# Altium schematic sheet Fan.SchDoc
size A4; SheetNumber: 9; SheetTotal: 16
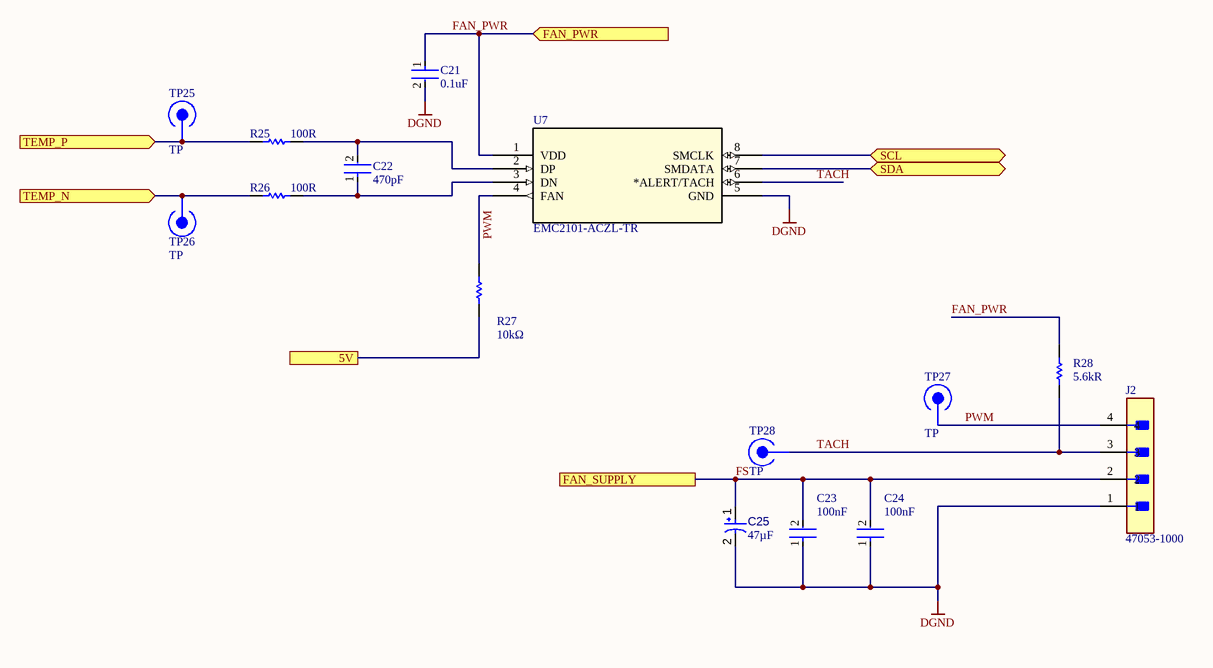
[diagram p0: Fan.SchDoc]

## Parts
C21  value 0.1uF  [FP-CC0402-IPC_C]  (hidden comment: CC0402KRX7R7BB104)
C22  value 470pF  [FP-0402-L_1_0_1-W_0_5_0_1-IPC_C]  (hidden comment: C0402C471K5RACTU)
C23  value 100nF  [FP-CC0402-IPC_B]  (hidden comment: CC0402KRX7R9BB104)
C24  value 100nF  [FP-CC0402-IPC_B]  (hidden comment: CC0402KRX7R9BB104)
C25  value 47µF  [VISH-7343-31_N]  (hidden comment: 293D476X9016D2TE3)
J2  47053-1000  [FP-470531000-MFG]
R25  value 100R  [RESC1005X40X25LL10T10]  (hidden comment: RK73H1ETTP1000F)
R26  value 100R  [RESC1005X40X25LL10T10]  (hidden comment: RK73H1ETTP1000F)
R27  value 10kΩ  [RESC1005X40X25LL10T10]  (hidden comment: RK73B1ETTP103J)
R28  value 5.6kR  [RESC1005X40X25LL10T10]  (hidden comment: RK73H1ETTP5601F)
TP25  TP  [TP-Footprint-1]
TP26  TP  [TP-Footprint-1]
TP27  TP  [TP-Footprint-1]
TP28  TP  [TP-Footprint-1]
U7  EMC2101-ACZL-TR  [EMC2101-ACZL-TR-Footprint-1]

## Ports
5V, FAN_PWR (in), FAN_SUPPLY, SCL (bidir), SDA (bidir), TEMP_N (in), TEMP_P (in)

## Nets
DGND: C21.2 C23.1 C24.1 C25.2 J2.1 U7.5(GND)
5V: R27.2 ; port 5V
FAN_PWR: C21.1 R28.2 U7.1(VDD) ; port FAN_PWR
FS: C23.2 C24.2 C25.1 J2.2 ; port FAN_SUPPLY
PWM: J2.4 R27.1 TP27.1 U7.4(FAN)
SCL: U7.8(SMCLK) ; port SCL
SDA: U7.7(SMDATA) ; port SDA
TACH: J2.3 R28.1 TP28.1 U7.6(*ALERT/TACH)
TEMP_N: R26.1 TP26.1 ; port TEMP_N
TEMP_P: R25.1 TP25.1 ; port TEMP_P
NetC22_1: C22.1 R26.2 U7.3(DN)
NetC22_2: C22.2 R25.2 U7.2(DP)

## Library data of the parts
C21 = CMP-001-00094-1: Multilayer Ceramic Capacitor, 0.1 uF, 25 V, ± 10%, X7R, 0402 [1005 Metric]; Rating: 16V; Reel Size: 8mm; Vendor: TTI; Category: Capacitor; Price: 0.004; Package: 0402; MOQ: 10000
C22 = CMP-001-00097-1: CAPACITOR - Ceramic Chip Cap, 0402, 470 pf, 10%, 50V, X7R; Reel Size: 8mm; Vendor: TTI; Price: 0.003; MOQ: 10000; Package: 0402; Category: Capacitor; Rating: 50V
C23 C24 = CMP-x00152-1: Ceramic Capacitor, Multilayer, Ceramic, 50V, 10% +Tol, 10% -Tol, X7R, 15% TC, 0.1uF, Surface Mount, 0402
C25 = CMP-001-00022-7: Solid Tantalum Chip Capacitor, 47 uF, +/- 10%, 16 V, -55 to 125 degC, 2917 (7343 Metric), RoHS, Tape and Reel; Manufacturer: Vishay Semiconductor; Voltage Rating: 16V; Datasheet URL: http://www.vishay.com/docs/40002/293d.pdf; Max Operating Temperature: 125°C; Packaging: TapeandReel; Mounting Technology: SM; Capacitor Type: Tantalum; Tolerance: 10%; Min Operating Temperature: -55°C; Package Reference: 7343-31; RoHS Compliant: Unknown; Manufacturer URL: http://www.vishay.com/; Datasheet Version: Aug-16; Package Description: 2-Pin Surface Mount Device, Body 7.3 x 4.3 mm; Case/Package: 7343-31
J2 = CMP-04776-000290-2: CONN HEADER VERT 4POS 2.54MM; NexarPartId: 854935; Manufacturer Lifecycle Status: ACTIVE; Voltage Rating (DC): 250V; Gender: Male; Plating: Copper; Number of Positions: 4; Glow Wire Compliant: Non-compliant; Current Rating: 500mA; Max Operating Temperature: 75°C; Number of Rows: 1; REACH SVHC: Unknown; Ambient Temperature Range High: 105°C; Pitch: 2.54mm; Height: 7.7mm; Min Operating Temperature: 0°C; Packaging: Bulk; Contact Material: Brass, Copper; Contact Plating: Tin; Lead Pitch: 2.54mm; Voltage Rating: 250V; Termination: Through Hole; Radiation Hardening: No; Orientation: Vertical; Mount: Through Hole; Number of Pins: 4; Country of Origin: HK; Halogen Free: Low Halogen; Lifecycle Status: Production; Number of Circuits: 4; Schedule B: 8536694040, 8536694040; Housing Color: Beige; Housing Material: Nylon; Depth: 5.84mm; RoHS: Compliant; Length: 10.2mm; Number of Contacts: 4
R25 R26 = CMP-x00174-1: Fixed Resistor, Metal Glaze/thick Film, 0.1W, 100ohm, 75V, 1% +/-Tol, 100ppm/Cel, Surface Mount, 0402
R27 = CMP-009-00227-1: Fixed Resistor, Metal Glaze/thick Film, 0.1W, 10000ohm, 75V, 5% +/-Tol, 200ppm/Cel, Surface Mount, 0402; Rating: 1/10W; Vendor: TTI; Package: 0402; Price: 0.0017; Category: Resistor
R28 = CMP-x00164-1: Fixed Resistor, Metal Glaze/thick Film, 0.1W, 5600ohm, 75V, 1% +/-Tol, 100ppm/Cel, Surface Mount, 0402
TP25-TP28 = CMP-001-0086-3: digital shovel test point
U7 = CMP-x00137-1: Serial Switch/Digital Sensor, 11 Bit(s), 2Cel, Square, Surface Mount; Manufacturer: Microchip; Reel Width: 8mm; Template: MC_TSSOP_8; Vendor: Mouser; Mounting: SMT; Package: TSSOP_8; Category: Integrated Circuit; Price: 1.62; MOQ: 1